# EAGLE design lamp (EAGLE 6.4)
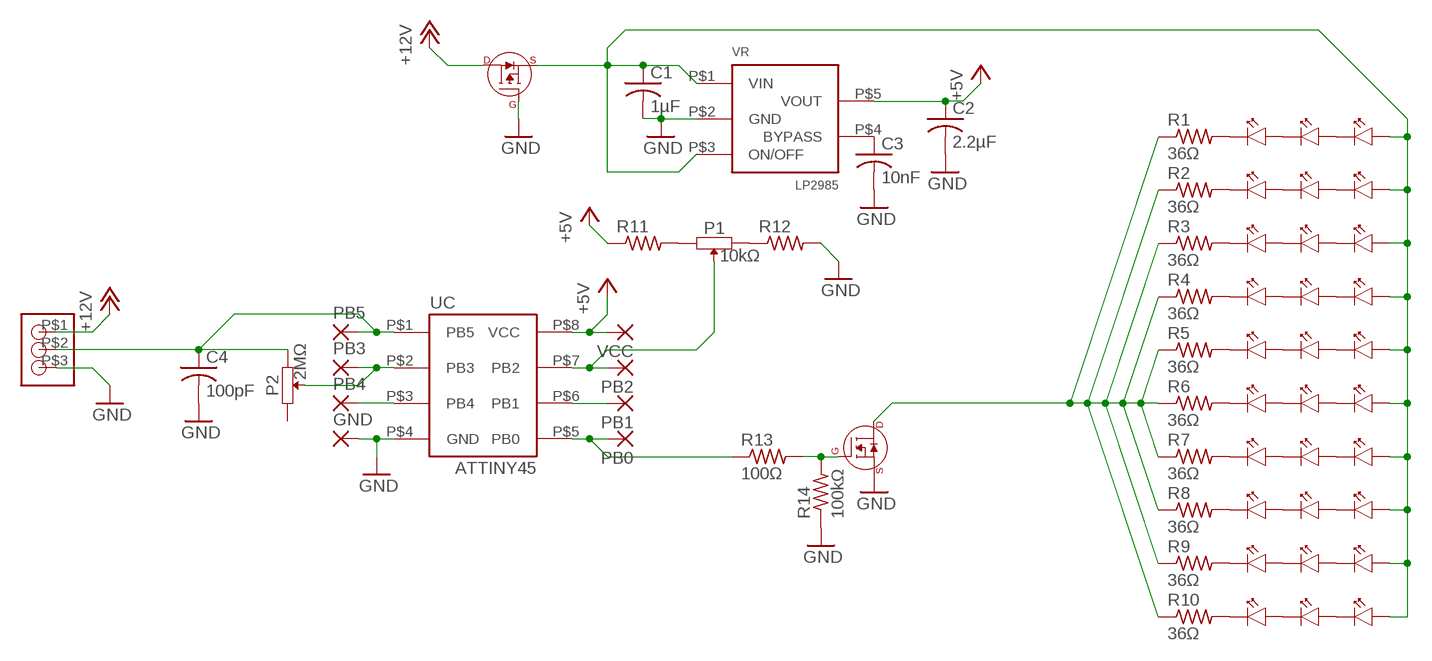
[diagram p0: schematic, sheet 1]

## Parts
C1  1µF  CAPACITOR-SMD  [0805]
C2  2.2µF  CAPACITOR-SMD  [0805]
C3  10nF  CAPACITOR-SMD  [0805]
C4  100pF  CAPACITOR-SMD  [0805]
F1  SI2318DS  [SOT-23-3]
F2  SI2319DS  [SOT-23-3]
GND  SMD2  [SMD1,27-2,54]
P1  10kΩ  PVG3G  [3361P]
P2  2MΩ  PVG3G  [3361P]
PB0  SMD2  [SMD1,27-2,54]
PB1  SMD2  [SMD1,27-2,54]
PB2  SMD2  [SMD1,27-2,54]
PB3  SMD2  [SMD1,27-2,54]
PB4  SMD2  [SMD1,27-2,54]
PB5  SMD2  [SMD1,27-2,54]
R1  36Ω  RESISTOR-SMD  [0805]
R2  36Ω  RESISTOR-SMD  [0805]
R3  36Ω  RESISTOR-SMD  [0805]
R4  36Ω  RESISTOR-SMD  [0805]
R5  36Ω  RESISTOR-SMD  [0805]
R6  36Ω  RESISTOR-SMD  [0805]
R7  36Ω  RESISTOR-SMD  [0805]
R8  36Ω  RESISTOR-SMD  [0805]
R9  36Ω  RESISTOR-SMD  [0805]
R10  36Ω  RESISTOR-SMD  [0805]
R11  RESISTOR-SMD  [0805]
R12  RESISTOR-SMD  [0805]
R13  100Ω  RESISTOR-SMD  [0805]
R14  100kΩ  RESISTOR-SMD  [0805]
U$1  CLA1BWKWMKW-4  [PLCC4]
U$2  CLA1BWKWMKW-4  [PLCC4]
U$3  CLA1BWKWMKW-4  [PLCC4]
U$4  CLA1BWKWMKW-4  [PLCC4]
U$5  CLA1BWKWMKW-4  [PLCC4]
U$6  CLA1BWKWMKW-4  [PLCC4]
U$7  CLA1BWKWMKW-4  [PLCC4]
U$8  CLA1BWKWMKW-4  [PLCC4]
U$9  CLA1BWKWMKW-4  [PLCC4]
U$10  CLA1BWKWMKW-4  [PLCC4]
U$11  CLA1BWKWMKW-4  [PLCC4]
U$12  CLA1BWKWMKW-4  [PLCC4]
U$13  CLA1BWKWMKW-4  [PLCC4]
U$14  CLA1BWKWMKW-4  [PLCC4]
U$15  CLA1BWKWMKW-4  [PLCC4]
U$16  CLA1BWKWMKW-4  [PLCC4]
U$17  CLA1BWKWMKW-4  [PLCC4]
U$18  CLA1BWKWMKW-4  [PLCC4]
U$19  CLA1BWKWMKW-4  [PLCC4]
U$20  CLA1BWKWMKW-4  [PLCC4]
U$21  CLA1BWKWMKW-4  [PLCC4]
U$22  CLA1BWKWMKW-4  [PLCC4]
U$23  CLA1BWKWMKW-4  [PLCC4]
U$24  CLA1BWKWMKW-4  [PLCC4]
U$25  CLA1BWKWMKW-4  [PLCC4]
U$26  CLA1BWKWMKW-4  [PLCC4]
U$27  CLA1BWKWMKW-4  [PLCC4]
U$28  CLA1BWKWMKW-4  [PLCC4]
U$29  CLA1BWKWMKW-4  [PLCC4]
U$30  CLA1BWKWMKW-4  [PLCC4]
U$32  HEADER-3X1  [SM4]
UC  ATTINY45  [TSSOP-8]
VCC  SMD2  [SMD1,27-2,54]
VR  LP2985  [SOT-23-5]

## Nets
+5V: C2.1 R11.1 UC.P$8(VCC) VCC.1(P) VR.P$5(VOUT)
+12V: F2.P$3(DRAIN) U$32.P$1
GND: C1.2 C2.2 C3.2 C4.2 F1.S$2(SOURCE) F2.P$1(GATE) GND.1(P) R12.2 R14.1 U$32.P$3 UC.P$4(GND) VR.P$2(GND)
N$1: U$1.P$4 U$2.P$2
N$2: R1.2 U$3.P$4
N$3: U$2.P$4 U$3.P$2
N$4: U$4.P$4 U$5.P$2
N$5: R2.2 U$6.P$4
N$6: U$5.P$4 U$6.P$2
N$7: U$7.P$4 U$8.P$2
N$8: R3.2 U$9.P$4
N$9: U$8.P$4 U$9.P$2
N$10: U$10.P$4 U$11.P$2
N$11: R4.2 U$12.P$4
N$12: U$11.P$4 U$12.P$2
N$13: R6.2 U$18.P$4
N$15: F1.P$1(GATE) R13.2 R14.2
N$16: U$16.P$4 U$17.P$2
N$17: P1.P$3 R11.2
N$18: C4.1 P2.P$1 PB5.1(P) U$32.P$2 UC.P$1(PB5)
N$19: U$19.P$4 U$20.P$2
N$20: R7.2 U$21.P$4
N$21: U$20.P$4 U$21.P$2
N$22: U$22.P$4 U$23.P$2
N$23: R8.2 U$24.P$4
N$24: U$23.P$4 U$24.P$2
N$25: U$25.P$4 U$26.P$2
N$26: R9.2 U$27.P$4
N$27: U$26.P$4 U$27.P$2
N$28: U$28.P$4 U$29.P$2
N$29: R10.2 U$30.P$4
N$30: U$29.P$4 U$30.P$2
N$31: U$13.P$4 U$14.P$2
N$32: U$14.P$4 U$15.P$2
N$33: F1.P$3(DRAIN) R1.1 R2.1 R3.1 R4.1 R5.1 R6.1 R7.1 R8.1 R9.1 R10.1
N$34: P1.P$1 R12.1
N$36: P2.P$2 PB3.1(P) UC.P$2(PB3)
N$37: PB4.1(P) UC.P$3(PB4)
N$40: U$17.P$4 U$18.P$2
N$43: R5.2 U$15.P$4
N$45: C1.1 F2.S$2(SOURCE) U$1.P$2 U$4.P$2 U$7.P$2 U$10.P$2 U$13.P$2 U$16.P$2 U$19.P$2 U$22.P$2 U$25.P$2 U$28.P$2 VR.P$1(VIN) VR.P$3(ON/OFF)
N$46: C3.1 VR.P$4(BYPASS)
N$47: PB0.1(P) R13.1 UC.P$5(PB0)
N$50: P1.P$2 PB2.1(P) UC.P$7(PB2)
N$52: PB1.1(P) UC.P$6(PB1)
Unconnected: P2.P$3

## Library data of the parts
C1-C4 =  Barebones-Arduino:CAPACITOR: Ceramic capacitor
F1 = lamp:SI2318DS
F2 = lamp:SI2319DS
GND PB0 PB1-PB5 VCC = wirepad:SMD2: SMD PAD
P1 P2 = lamp:PVG3G
R1-R14 =  Barebones-Arduino:RESISTOR: Film resistor
U$1-U$30 = lamp:CLA1BWKWMKW-4
U$32 = lamp:HEADER-3X1
UC = lamp:ATTINY45
VR = lamp:LP2985

## Board
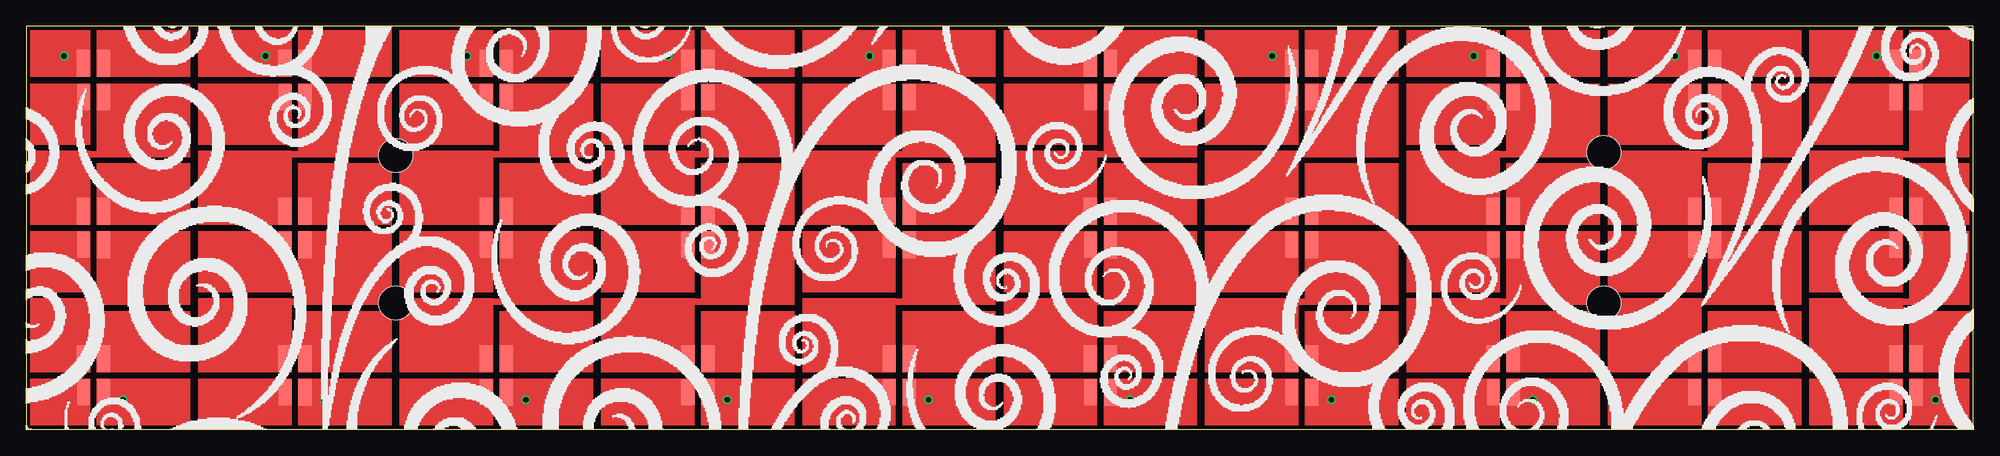
[diagram p1: board, top side]
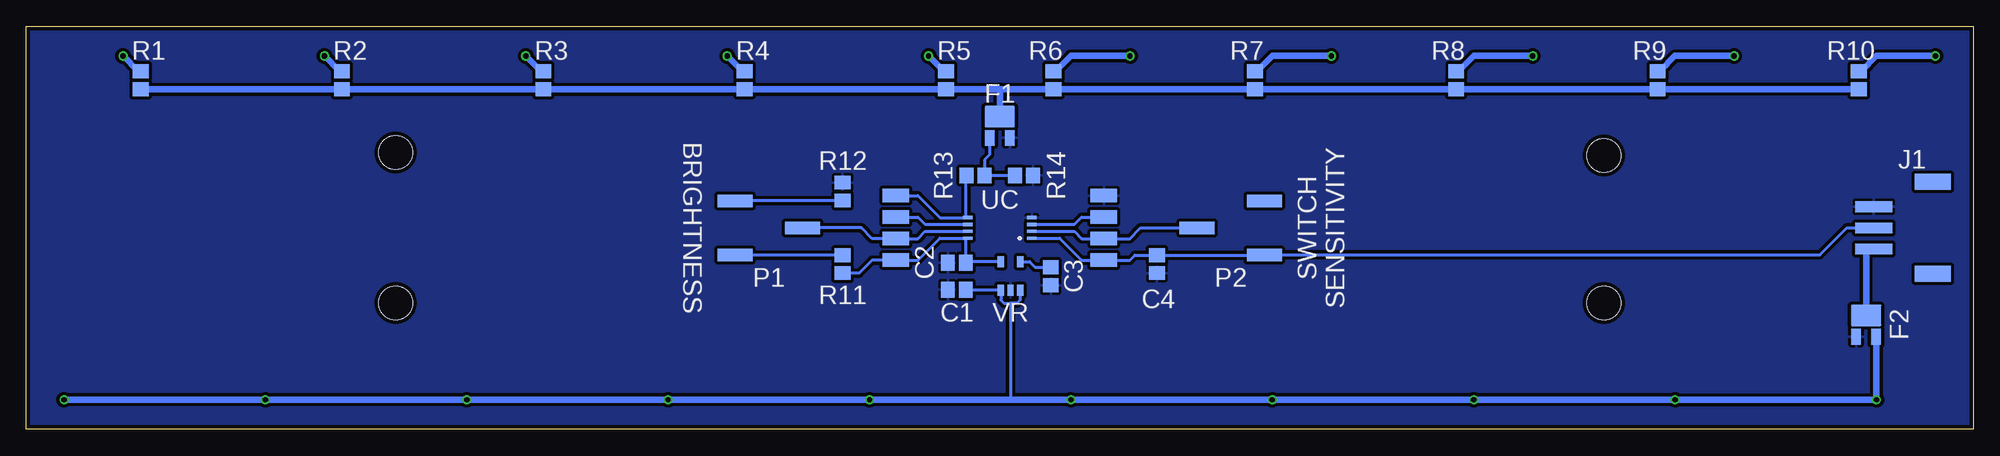
[diagram p2: board, bottom side, seen from below]

Size 184.15 x 38.1 mm. Coordinates in mm from the lower left corner, seen from the top.
Outline: 0,0 184.15,0 184.15,38.1 0,38.1 0,0
Copper layers (1*16): Top 0.0356mm / dielectric 1.5011mm / Bottom 0.0356mm
Design rules "LaenPCBOrder": minimum track width 6mil, minimum drill 13mil, track to track 6mil, track to pad 6mil, pad to pad 6mil, via to via 6mil, smd to smd 6mil, copper to edge 15mil, drill to drill 6mil, minimum pad ring 7mil, minimum via ring 7mil, stop-mask expansion 3mil, vias tented up to drill 0mil, thermal gap 10mil
Holes 3.17 mm at 34.92,11.94 149.22,11.94 34.92,25.91 149.22,26.16

### Footprints (pad centres in the part's own frame; a part is rotated, then mirrored left to right if it is on the bottom)
0805 = smd 1.3 x 1.5: 1 -0.85,0; 2 0.85,0
SOT-23-3 = smd 1 x 1.5: P$1 -0.95,-1.15; S$2 0.95,-1.15 | smd 2.9 x 2.05: P$3 0,0.875
SMD1,27-2,54 = smd 1.27 x 2.54: 1 0,0
3361P = smd 1.19 x 3.3: P$1 -2.55,-3.2; P$2 0,3.2; P$3 2.55,-3.21
PLCC4 = smd 2.54 x 1.27: P$1 -1.587,0.953; P$2 -1.587,-0.953; P$3 1.587,-0.953; P$4 1.587,0.953
SM4 = smd 1 x 3.5: P$1 2,-1.75; P$2 0,-1.75; P$3 -2,-1.75 | smd 1.5 x 3.4: P$4 4.35,3.8; P$5 -4.35,3.8
TSSOP-8 = smd 0.305 x 0.864: P$1 -0.975,-3.03; P$2 -0.325,-3.03; P$3 0.325,-3.03; P$4 0.975,-3.03; P$5 0.975,3.03; P$6 0.325,3.03; P$7 -0.325,3.03; P$8 -0.975,3.03
SOT-23-5 = smd 0.6 x 1.05: P$1 -0.92,-1.32; P$2 0,-1.32; P$3 0.92,-1.32; P$4 0.92,1.37; P$5 -0.92,1.37

### Placement (x,y rotation side)
C1  96.14,13.21 180 bottom
C2  96.14,15.75 180 bottom
C3  87.25,14.48 270 bottom
C4  77.22,15.62 270 bottom
F1  92.08,28.7 0 bottom
F2  10.11,9.91 0 bottom
GND  82.23,22.1 90 bottom
P1  113.92,19.05 270 bottom
P2  70.23,19.05 90 bottom
PB0  101.92,22.1 270 bottom
PB1  101.92,20.07 270 bottom
PB2  101.92,18.03 270 bottom
PB3  82.23,18.03 90 bottom
PB4  82.23,20.07 90 bottom
PB5  82.23,16 90 bottom
R1  173.35,33.02 90 bottom
R2  154.31,33.02 90 bottom
R3  135.25,33.02 90 bottom
R4  116.2,33.02 90 bottom
R5  97.16,33.02 90 bottom
R6  87,33.02 90 bottom
R7  67.94,33.02 90 bottom
R8  48.9,33.02 90 bottom
R9  29.84,33.02 90 bottom
R10  10.79,33.02 90 bottom
R11  106.93,15.62 90 bottom
R12  106.93,22.48 90 bottom
R13  94.36,24 0 bottom
R14  89.79,24 180 bottom
U$1  177.8,5.08 90 top
U$2  177.8,19.05 90 top
U$3  177.8,33.02 90 top
U$4  158.75,5.08 90 top
U$5  158.75,19.05 90 top
U$6  158.75,33.02 90 top
U$7  139.7,5.08 90 top
U$8  139.7,19.05 90 top
U$9  139.7,33.02 90 top
U$10  120.65,5.08 90 top
U$11  120.65,19.05 90 top
U$12  120.65,33.02 90 top
U$13  101.6,5.08 90 top
U$14  101.6,19.05 90 top
U$15  101.6,33.02 90 top
U$16  82.55,5.08 90 top
U$17  82.55,19.05 90 top
U$18  82.55,33.02 90 top
U$19  63.5,5.08 90 top
U$20  63.5,19.05 90 top
U$21  63.5,33.02 90 top
U$22  44.45,5.08 90 top
U$23  44.45,19.05 90 top
U$24  44.45,33.02 90 top
U$25  25.4,5.08 90 top
U$26  25.4,19.05 90 top
U$27  25.4,33.02 90 top
U$28  6.35,5.08 90 top
U$29  6.35,19.05 90 top
U$30  6.35,33.02 90 top
U$32  7.62,19.05 270 bottom
UC  92.08,19.05 90 bottom
VCC  101.92,16 270 bottom
VR  91.06,14.48 0 bottom

### Tracks (layer width: path | path; a pad name or v marks a point on that pad's centre or on a via)
+5V
  Bottom 0.305: VR.P$5 95.19,15.85 C2.1 95.29,18.07 UC.P$8 97.75,18.07 99.82,16 VCC.1 104.14,16 105.37,14.77 R11.1
+12V
  Bottom 0.305: 10.11,17.05 U$32.P$1
  Bottom 0.61: F2.P$3 10.11,17.05
GND
  pour Bottom (isolate 0.305): 0,0 0,38.1 184.15,38.1 184.15,0
N$1
  Top 0.61: U$1.P$4 176.85,12.06 178.75,12.06 U$2.P$2
N$2  (via drill 0.5)
  Top 0.61: v175.01,35.31 176.85,35.31 U$3.P$4
  Bottom 0.61: R1.2 173.57,33.87 v175.01,35.31
N$3
  Top 0.61: U$2.P$4 176.85,26.04 178.75,26.04 U$3.P$2
N$4
  Top 0.61: U$5.P$2 159.7,12.06 157.8,12.06 U$4.P$4
N$5  (via drill 0.5)
  Top 0.61: v155.96,35.31 157.8,35.31 U$6.P$4
  Bottom 0.61: R2.2 154.52,33.87 v155.96,35.31
N$6
  Top 0.61: U$6.P$2 159.7,26.04 157.8,26.04 U$5.P$4
N$7
  Top 0.61: U$7.P$4 138.75,12.06 140.65,12.06 U$8.P$2
N$8  (via drill 0.5)
  Top 0.61: v136.91,35.31 138.75,35.31 U$9.P$4
  Bottom 0.61: R3.2 135.47,33.87 v136.91,35.31
N$9
  Top 0.61: U$8.P$4 138.75,26.04 140.65,26.04 U$9.P$2
N$10
  Top 0.61: U$11.P$2 121.6,12.06 119.7,12.06 U$10.P$4
N$11  (via drill 0.5)
  Top 0.61: v117.86,35.31 119.7,35.31 U$12.P$4
  Bottom 0.61: R4.2 116.42,33.87 v117.86,35.31
N$12
  Top 0.61: U$12.P$2 121.6,26.04 119.7,26.04 U$11.P$4
N$13  (via drill 0.5)
  Top 0.61: U$18.P$4 81.6,35.31 v79.76,35.31
  Bottom 0.61: R6.2 86.78,33.87 85.34,35.31 v79.76,35.31
N$15
  Bottom 0.305: R14.2 R13.2 93.51,25.49 93.03,25.97 F1.P$1
N$16
  Top 0.61: U$17.P$2 83.5,12.06 81.6,12.06 U$16.P$4
N$17
  Bottom 0.305: R11.2 117.13,16.47 P1.P$3
N$18
  Bottom 0.305: UC.P$1 86.4,18.07 84.33,16 PB5.1 79.76,16 79.29,16.47 C4.1 67.06,16.47 P2.P$1 14.49,16.5 11.94,19.05 U$32.P$2
N$19
  Top 0.61: U$20.P$2 64.45,12.06 62.55,12.06 U$19.P$4
N$20  (via drill 0.5)
  Top 0.61: U$21.P$4 62.55,35.31 v60.71,35.31
  Bottom 0.61: R7.2 67.73,33.87 66.29,35.31 v60.71,35.31
N$21
  Top 0.61: U$20.P$4 62.55,26.04 64.45,26.04 U$21.P$2
N$22
  Top 0.61: U$23.P$2 45.4,12.06 43.5,12.06 U$22.P$4
N$23  (via drill 0.5)
  Top 0.61: U$24.P$4 43.5,35.31 v41.66,35.31
  Bottom 0.61: R8.2 48.68,33.87 47.24,35.31 v41.66,35.31
N$24
  Top 0.61: U$24.P$2 45.4,26.04 43.5,26.04 U$23.P$4
N$25
  Top 0.61: U$26.P$2 26.35,12.06 25.4,12.06 24.77,12.06 24.45,12.06 U$25.P$4
N$26  (via drill 0.5)
  Top 0.61: U$27.P$4 24.45,35.31 v22.61,35.31
  Bottom 0.61: R9.2 29.63,33.87 28.19,35.31 v22.61,35.31
N$27
  Top 0.61: U$27.P$2 26.35,26.04 24.45,26.04 U$26.P$4
N$28
  Top 0.61: U$29.P$2 7.3,12.06 5.4,12.06 U$28.P$4
N$29  (via drill 0.5)
  Top 0.61: U$30.P$4 5.4,35.31 v3.56,35.31
  Bottom 0.61: R10.2 10.58,33.87 9.14,35.31 v3.56,35.31
N$30
  Top 0.61: U$29.P$4 5.4,26.04 7.3,26.04 U$30.P$2
N$31
  Top 0.61: U$13.P$4 100.65,12.06 102.55,12.06 U$14.P$2
N$32
  Top 0.61: U$14.P$4 100.65,26.04 102.55,26.04 U$15.P$2
N$33
  Bottom 0.61: R10.1 R9.1 R8.1 R7.1 R6.1 92.08,32.17 | R1.1 R2.1 R3.1 R4.1 R5.1 | R5.1 92.08,32.17 | R5.1 93.03,32.17 | F1.P$3 92.08,32.17
N$34
  Bottom 0.305: R12.1 117.12,21.63 P1.P$1
N$36
  Bottom 0.305: UC.P$2 85.02,18.73 84.33,18.03 PB3.1 79.76,18.03 78.74,19.05 P2.P$2
N$37
  Bottom 0.305: UC.P$3 85.02,19.38 84.33,20.07 PB4.1
N$40
  Top 0.61: U$18.P$2 83.5,26.04 81.6,26.04 U$17.P$4
N$43  (via drill 0.5)
  Top 0.61: v98.81,35.31 100.65,35.31 U$15.P$4
  Bottom 0.61: R5.2 97.37,33.87 v98.81,35.31
N$45  (via drill 0.5)
  Top 0.61: 178.75,2.79 178.82,2.79 | 178.82,2.79 v180.59,2.79 | v161.54,2.79 159.7,2.79 U$4.P$2 | v142.49,2.79 140.65,2.79 U$7.P$2 | v123.44,2.79 121.6,2.79 U$10.P$2 | v104.39,2.79 102.55,2.79 U$13.P$2 | U$16.P$2 83.5,2.79 v85.34,2.79 | U$19.P$2 64.45,2.79 v66.29,2.79 | U$22.P$2 45.4,2.79 v47.24,2.79 | U$25.P$2 26.35,2.79 v28.19,2.79 | U$28.P$2 7.3,2.79 v9.14,2.79 | 178.82,2.79 178.82,3.49 U$1.P$2
  Bottom 0.305: VR.P$3 90.14,12.22 90.42,11.94 91.06,11.94 | C1.1 95.29,13.16 VR.P$1 91.98,12.22 91.69,11.94 91.06,11.94 | 91.06,11.94 91.06,2.79 88.9,2.79 | 9.16,2.79 v9.14,2.79
  Bottom 0.61: v9.14,2.79 v28.19,2.79 v47.24,2.79 v66.29,2.79 v85.34,2.79 88.9,2.79 v104.39,2.79 v123.44,2.79 v142.49,2.79 v161.54,2.79 v180.59,2.79 | F2.S$2 9.16,2.79
N$46
  Bottom 0.305: VR.P$4 89.25,15.85 88.73,15.33 C3.1
N$47
  Bottom 0.305: PB0.1 99.82,22.1 97.75,20.02 95.29,20.02 | 95,20.02 UC.P$5 95.29,20.02 | 95.29,20.02 95.29,24 R13.1
N$50
  Bottom 0.305: UC.P$7 99.13,18.73 99.82,18.03 PB2.1 104.14,18.03 105.16,19.05 P1.P$2
N$52
  Bottom 0.305: PB1.1 99.82,20.07 99.13,19.38 UC.P$6
(copper drawn outside any net)
  shapes: Top area x120

### Text on the board
bNames: R10 | R9 | R8 | R7 | R6 | R5 | R4 | R3 | R2 | R1 | F1 | J1 | R12 | R14 | R13 | UC | SWITCH / SENSITIVITY | BRIGHTNESS | C2 | P2 | P1 | C3 | R11 | C4 | VR | C1 | F2